# Altium schematic sheet LoadWrover_HRD.SchDoc
size D; SheetNumber: 1; SheetTotal: 1
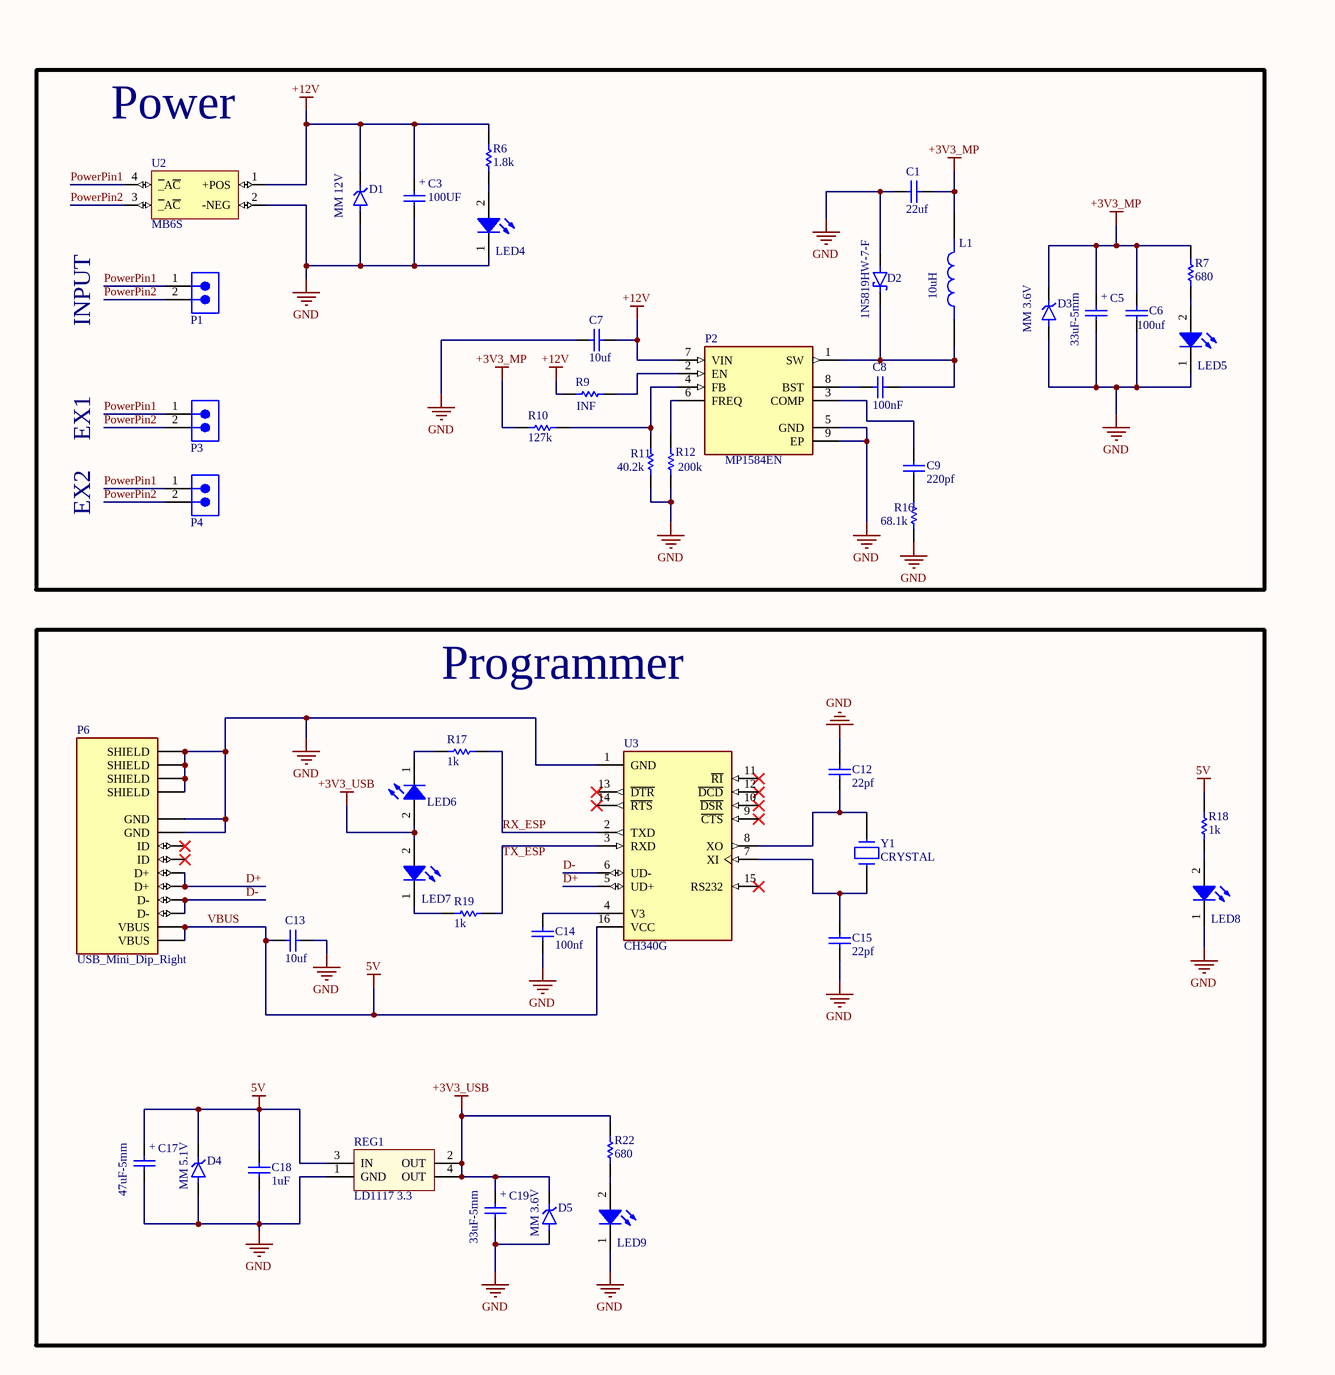
[diagram p0: LoadWrover_HRD.SchDoc, left]
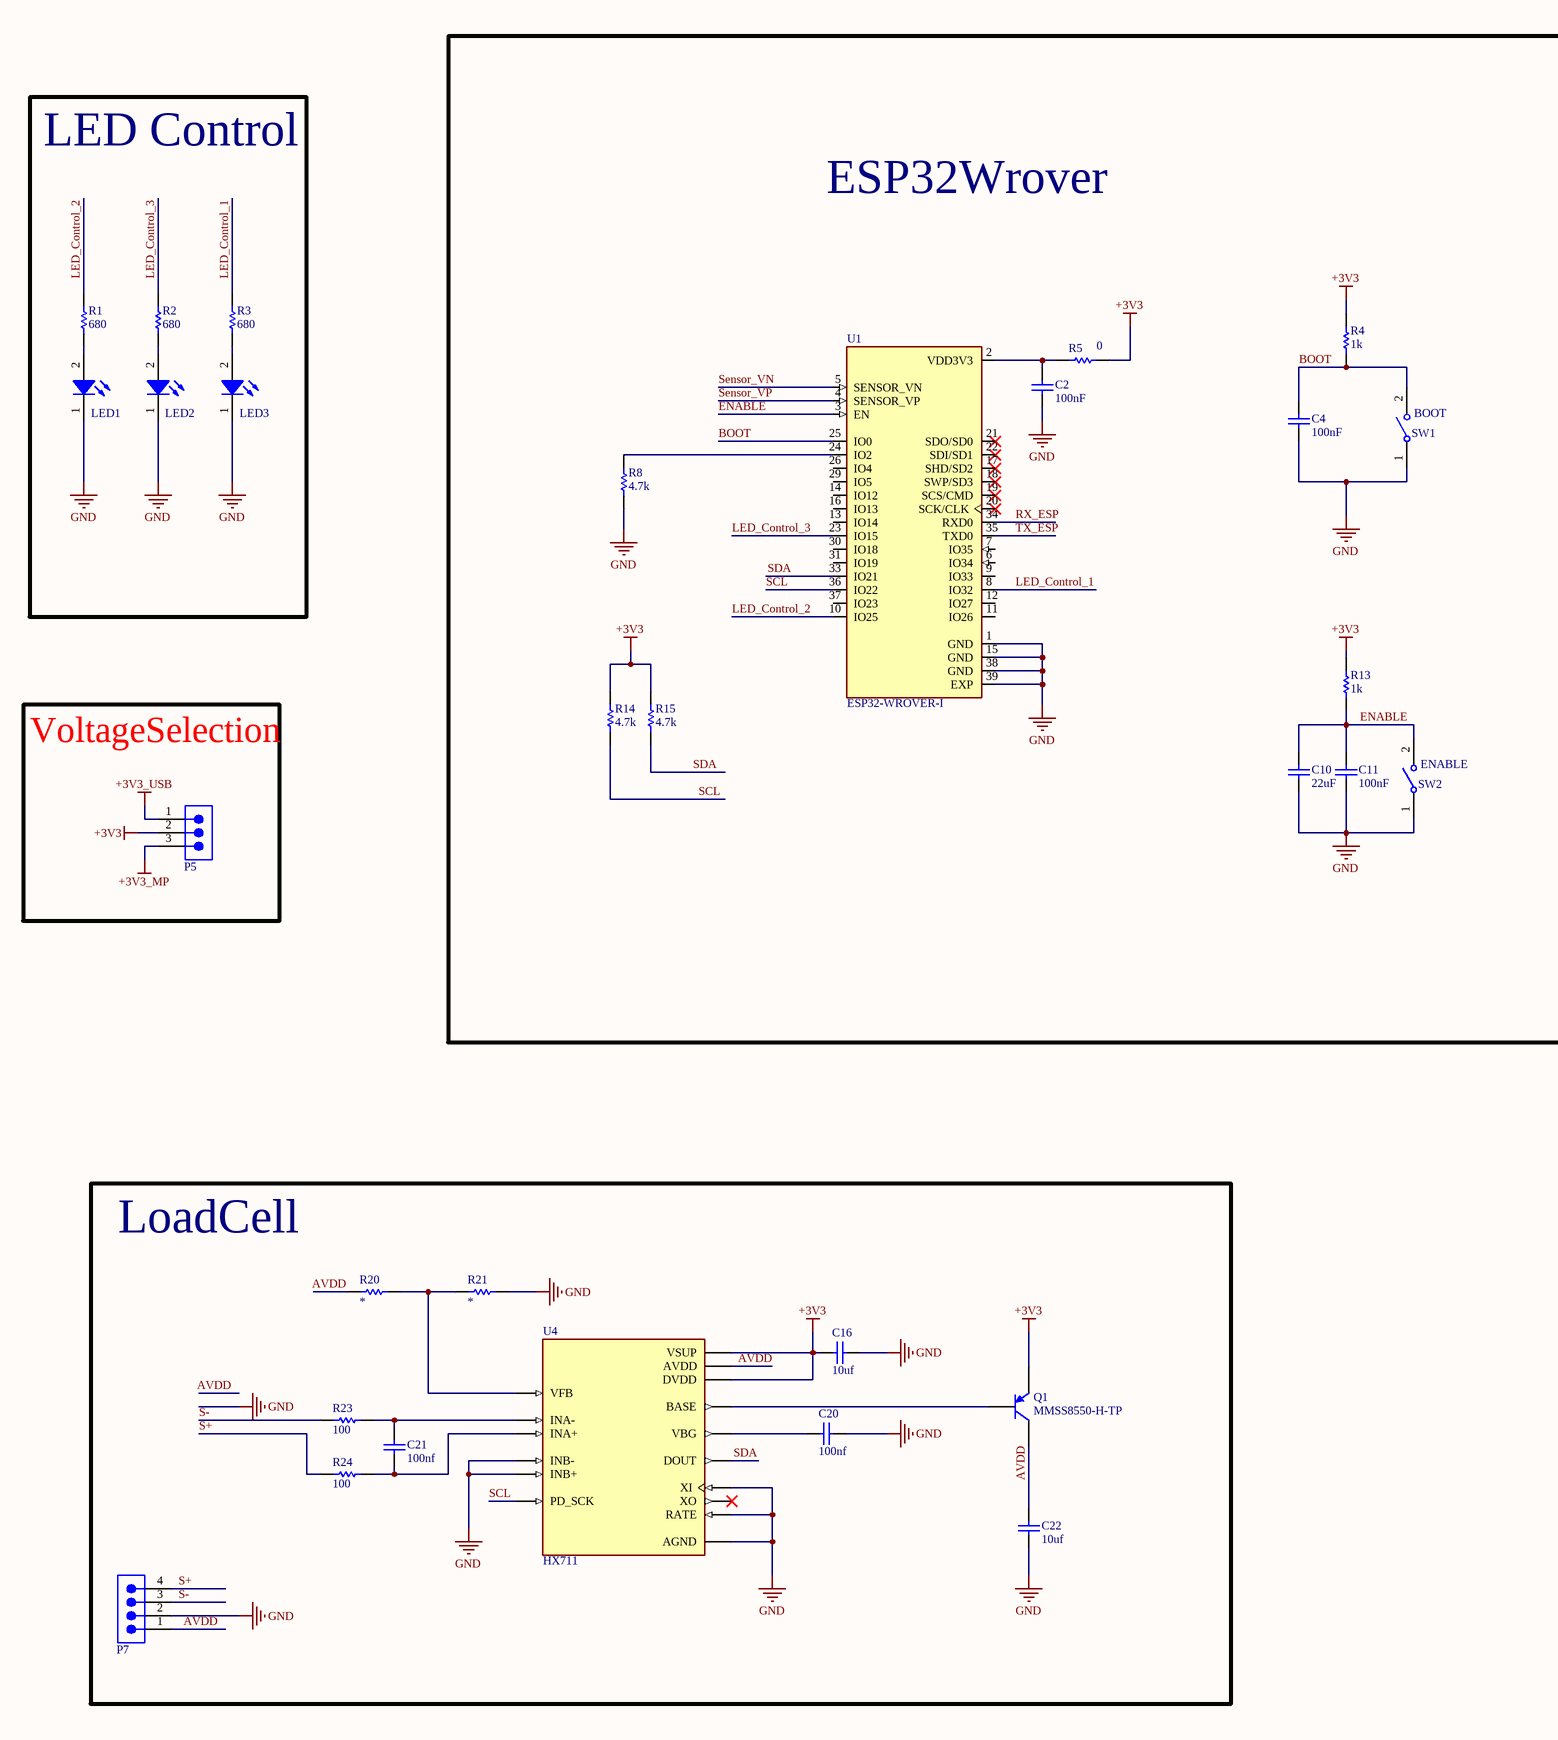
[diagram p1: LoadWrover_HRD.SchDoc, right]

## Parts
C1  22uf  [SMD 805 CAP]
C2  100nF  [SMD 805 CAP]
C3  100UF  [MY_CAP_POL 6MM]
C4  100nF  [SMD 805 CAP]
C5  33uF-5mm  [MY_CAP_POL 5MM]
C6  100uf  [SMD 805 CAP]
C7  10uf  [SMD 805 CAP]
C8  100nF  [SMD 805 CAP]
C9  220pf  [SMD 805 CAP]
C10  22uF  [SMD 805 CAP]
C11  100nF  [SMD 805 CAP]
C12  22pf  [SMD 805 CAP]
C13  10uf  [SMD 805 CAP]
C14  100nf  [SMD 805 CAP]
C15  22pf  [SMD 805 CAP]
C16  10uf  [SMD 805 CAP]
C17  47uF-5mm  [MY_CAP_POL 5MM]
C18  1uF  [SMD 805 CAP]
C19  33uF-5mm  [MY_CAP_POL 5MM]
C20  100nf  [SMD 805 CAP]
C21  100nf  [SMD 805 CAP]
C22  10uf  [SMD 805 CAP]
D1  MM 12V  [MiniMelf]
D2  1N5819HW-7-F  [1N5819HW-7-F]
D3  MM 3.6V  [MiniMelf]
D4  MM 5.1V  [MiniMelf]
D5  MM 3.6V  [MiniMelf]
L1  10uH  [Inductor-4*4*3]
LED1  LED_SMD_0805  [LED_0805]  (value not drawn)
LED2  LED_SMD_0805  [LED_0805]  (value not drawn)
LED3  LED_SMD_0805  [LED_0805]  (value not drawn)
LED4  LED_SMD_0805  [LED_0805]  (value not drawn)
LED5  LED_SMD_0805  [LED_0805]  (value not drawn)
LED6  LED_SMD_0805  [LED_0805]  (value not drawn)
LED7  LED_SMD_0805  [LED_0805]  (value not drawn)
LED8  LED_SMD_0805  [LED_0805]  (value not drawn)
LED9  LED_SMD_0805  [LED_0805]  (value not drawn)
P1  691312510002  [691312510002]  (value not drawn)
P2  MP1584EN  [MP1584EN]
P3  691312510002  [691312510002]  (value not drawn)
P4  691312510002  [691312510002]  (value not drawn)
P5  61300311121  [61300311121]  (value not drawn)
P6  USB_Mini_Dip_Right  [USB_MINI_Right]
P7  691312510004  [691312510004]  (value not drawn)
Q1  MMSS8550-H-TP  [MY_SMD_TRANSISTOR]
R1  680  [SMD 805]
R2  680  [SMD 805]
R3  680  [SMD 805]
R4  1k  [SMD 805]
R5  0  [SMD 805]
R6  1.8k  [SMD 805]
R7  680  [SMD 805]
R8  4.7k  [SMD 805]
R9  INF  [SMD 805]
R10  127k  [SMD 805]
R11  40.2k  [SMD 805]
R12  200k  [SMD 805]
R13  1k  [SMD 805]
R14  4.7k  [SMD 805]
R15  4.7k  [SMD 805]
R16  68.1k  [SMD 805]
R17  1k  [SMD 805]
R18  1k  [SMD 805]
R19  1k  [SMD 805]
R20  *  [SMD 805]
R21  *  [SMD 805]
R22  680  [SMD 805]
R23  100  [SMD 805]
R24  100  [SMD 805]
REG1  LD1117 3.3  [MY_LD1117-3.3]
SW1  BOOT  [WS-TASV_L6W3.5H4.3_4341x10438x6]
SW2  ENABLE  [WS-TASV_L6W3.5H4.3_4341x10438x6]
U1  ESP32-WROVER-I  [ESP32-WROVER-I]
U2  MB6S  [MB6S]
U3  CH340G  [CH340G]
U4  HX711  [HX711]
Y1  CRYSTAL  [My_Crystal]

## Blocks framed on the sheet
ESP32Wrover: C2 C4 C10 C11 R4 R5 R8 R13-R15 SW1 SW2 U1
LED Control: LED1-LED3 R1-R3
Power: C1 C3 C5-C9 D1-D3 L1 LED4 LED5 P1-P4 R6 R7 R9-R12 R16 U2
VoltageSelection: P5
Programmer: C12-C15 C17-C19 D4 D5 LED6-LED9 P6 R17-R19 R22 REG1 U3 Y1
LoadCell: C16 C20-C22 P7 Q1 R20 R21 R23 R24 U4

## Nets
+3V3: C16.2 P5.2 Q1.E R4.1 R5.2 R13.2 R14.1 R15.1 U4.1(VSUP) U4.16(DVDD)
+3V3_MP: C1.2 C5.+ C6.2 D3.2 L1.2 P5.3 R7.2 R10.2
+3V3_USB: C19.+ D5.2 LED6.2(A) LED7.2(A) P5.1 R22.2 REG1.2(OUT) REG1.4(OUT)
+12V: C3.+ C7.2 D1.2 P2.7(VIN) R6.2 R9.1 U2.1(+POS)
GND: C1.1 C2.1 C3.- C4.1 C5.- C6.1 C7.1 C10.1 C11.1 C12.2 C13.2 C14.1 C15.1 C16.1 C17.- C18.1 C19.- C20.1 C22.2 D1.1 D2.A D3.1 D4.1 D5.1 LED1.1(K) LED2.1(K) LED3.1(K) LED4.1(K) LED5.1(K) LED8.1(K) LED9.1(K) P2.5(GND) P2.9(EP) P6.5(GND) P6.10(GND) P6.11(SHIELD) P6.12(SHIELD) P6.S1(SHIELD) P6.S2(SHIELD) P7.2 R8.2 R11.1 R12.1 R16.1 R21.1 REG1.1(GND) SW1.1 SW2.1 U1.1(GND) U1.15(GND) U1.38(GND) U1.39(EXP) U2.2(-NEG) U3.1(GND) U4.5(AGND) U4.9(INB-) U4.10(INB+) U4.14(XI) U4.15(RATE)
VBUS: C13.1 C17.+ C18.2 D4.2 P6.1(VBUS) P6.6(VBUS) R18.2 REG1.3(IN) U3.16(VCC)  [also labelled 5V]
AVDD: C22.1 P7.1 Q1.C R20.2 U4.3(AVDD)
BOOT: C4.2 R4.2 SW1.2 U1.25(IO0)
D+: P6.3(D+) P6.8(D+) U3.5(UD+)
D-: P6.2(D-) P6.7(D-) U3.6(UD-)
ENABLE: C10.2 C11.2 R13.1 SW2.2 U1.3(EN)
LED_Control_1: R3.2 U1.8(IO32)
LED_Control_2: R1.2 U1.10(IO25)
LED_Control_3: R2.2 U1.23(IO15)
PowerPin1: P1.1 P3.1 P4.1 U2.4(~{_}A~{C})
PowerPin2: P1.2 P3.2 P4.2 U2.3(~{_}A~{C})
RX_ESP: R17.1 U1.34(RXD0) U3.2(TXD)
S+: P7.4 R24.2
S-: P7.3 R23.2
SCL: R14.2 U1.36(IO22) U4.11(PD_SCK)
SDA: R15.2 U1.33(IO21) U4.12(DOUT)
Sensor_VN: U1.5(SENSOR_VN)
Sensor_VP: U1.4(SENSOR_VP)
TX_ESP: R19.1 U1.35(TXD0) U3.3(RXD)
NetC2_2: C2.2 R5.1 U1.2(VDD3V3)
NetC8_1: C8.1 P2.8(BST)
NetC8_2: C8.2 D2.C(K) L1.1 P2.1(SW)
NetC9_1: C9.1 P2.3(COMP)
NetC9_2: C9.2 R16.2
NetC12_1: C12.1 U3.8(XO) Y1.2
NetC14_2: C14.2 U3.4(V3)
NetC15_2: C15.2 U3.7(XI) Y1.1
NetC20_2: C20.2 U4.6(VBG)
NetC21_1: C21.1 R24.1 U4.8(INA+)
NetC21_2: C21.2 R23.1 U4.7(INA-)
NetLED1_2: LED1.2(A) R1.1
NetLED2_2: LED2.2(A) R2.1
NetLED3_2: LED3.2(A) R3.1
NetLED4_2: LED4.2(A) R6.1
NetLED5_2: LED5.2(A) R7.1
NetLED6_1: LED6.1(K) R17.2
NetLED7_1: LED7.1(K) R19.2
NetLED8_2: LED8.2(A) R18.1
NetLED9_2: LED9.2(A) R22.1
NetP2_2: P2.2(EN) R9.2
NetP2_4: P2.4(FB) R10.1 R11.2
NetP2_6: P2.6(FREQ) R12.2
NetQ1_B: Q1.B U4.2(BASE)
NetR8_1: R8.1 U1.24(IO2)
NetR20_1: R20.1 R21.2 U4.4(VFB)

Not connected (* = marked no-connect by the designer): P6 4(ID)* 9(ID)*; U1 6(IO34) 7(IO35) 9(IO33) 11(IO26) 12(IO27) 13(IO14) 14(IO12) 16(IO13) 17(SHD/SD2)* 18(SWP/SD3)* 19(SCS/CMD)* 20(SCK/CLK)* 21(SDO/SD0)* 22(SDI/SD1)* 26(IO4) 29(IO5) 30(IO18) 31(IO19) 37(IO23); U3 9(~{CTS})* 10(~{DSR})* 11(~{RI})* 12(~{DCD})* 13(~{DTR})* 14(~{RTS})* 15(RS232)*; U4 13(XO)*

## Notes on the sheet
- INPUT
- EX1
- EX2

## Library data of the parts
C1 C6 C7 C9 C12-C16 C20-C22 = CAP B: 1uf
C2 C4 C8 C10 C11 C18 = CAP B
C3 = Cap Pol_6mm: CAP-3300Uf
C5 C17 C19 = Cap Pol_5mm: CAP-3300Uf; Value: 3300u
D1 D3-D5 = MiniMelf_500mW: MP: ZM4736A_L0; Package: None; Availability: Unavailable; Price: None; Value: *
L1 = Inductor4*4*3
P1 P3 P4 = 691312510002: WR-TBL Series 312 Open Horizontal PCB Header, THT, pitch 5.08mm, 2p; Manufacturer: Wurth Elektronik; Modularity: No; Rated Current: 20A; Working Voltage: 300V; ComponentLink1Description: Website Link; ComponentLink1URL: https://www.we-online.com/redexpert/article/691312510002?ad; ComponentLink2Description: Datasheet Link; ComponentLink2URL: https://www.we-online.com/redexpert/spec/691312510002?ad; Manufacturer Part Number: 691312510002; Category: Terminal Blocks; Match Code: WR-TBL; Mount: Through Hole; Operating Temperature Max: 105°C; Operating Temperature Min: -40°C; Packaging: Box; Application: Pluggable; Number of Pins: 2; Number of Rows: 1; Orientation: Horizontal; Pitch: 5.08mm
P5 = 61300311121: WR-PHD Pin Header, THT, Vertical, pitch 2.54mm, 1 Row, 3P; Manufacturer: Wurth Elektronik; Contact Resistance: 20mΩ; Rated Current: 3A; Working Voltage: 250V; Withstanding Voltage: 500V; ComponentLink1Description: Website Link; ComponentLink1URL: https://www.we-online.com/redexpert/article/61300311121?ad; ComponentLink2Description: Datasheet Link; ComponentLink2URL: https://www.we-online.com/redexpert/spec/61300311121?ad; Manufacturer Part Number: 61300311121; Category: Board-to-Board Connectors; Match Code: WR-PHD; Mount: Through Hole; Operating Temperature Max: 105°C; Operating Temperature Min: -40°C; Packaging: Bag; Gender: Pin Header; Number of Pins: 3; Number of Rows: 1; Orientation: Vertical; Pitch: 2.54mm
P7 = 691312510004: WR-TBL Series 312 Open Horizontal PCB Header, THT, pitch 5.08mm, 4p; Manufacturer: Wurth Elektronik; Modularity: No; Rated Current: 20A; Working Voltage: 300V; ComponentLink1Description: Website Link; ComponentLink1URL: https://www.we-online.com/redexpert/article/691312510004?ad; ComponentLink2Description: Datasheet Link; ComponentLink2URL: https://www.we-online.com/redexpert/spec/691312510004?ad; Manufacturer Part Number: 691312510004; Category: Terminal Blocks; Match Code: WR-TBL; Mount: Through Hole; Operating Temperature Max: 105°C; Operating Temperature Min: -40°C; Packaging: Box; Application: Pluggable; Number of Pins: 4; Number of Rows: 1; Orientation: Horizontal; Pitch: 5.08mm
Q1 = 3906 SMD TRANSISTOR: PNP 60V 625mW IC=200mA
R1-R24 = Resistor
SW1 SW2 = 434111043826: WS-TASV SMT Tact Switch, L6 x W3.5 x H4.3mm, 260g, SPST-NO, 12V, 50mA; Manufacturer: Wurth Elektronik; Washable: No; Manufacturer Part Number: 434111043826; Category: Tact Switches; Match Code: WS-TASV; ComponentLink1Description: Website Link; ComponentLink1URL: https://www.we-online.com/redexpert/article/434111043826?ad; ComponentLink2Description: Datasheet Link; ComponentLink2URL: https://www.we-online.com/redexpert/spec/434111043826?ad; Mount: Surface Mount; Operating Temperature Max: 85°C; Operating Temperature Min: -40°C; Packaging: Tape and Reel; Length: 6mm; Width: 3.5mm; Height: 4.3mm; Circuit: SPST-NO; Contact Material: Stainless Steel; Contact Plating: Silver; Operation Force: 260g; Rated Current: 50mA; Rated Voltage (DC): 12V; Terminal Material: Copper Alloy; Terminal Plating: Silver